# EAGLE design InstrumentationBoard (EAGLE 7.2.0)
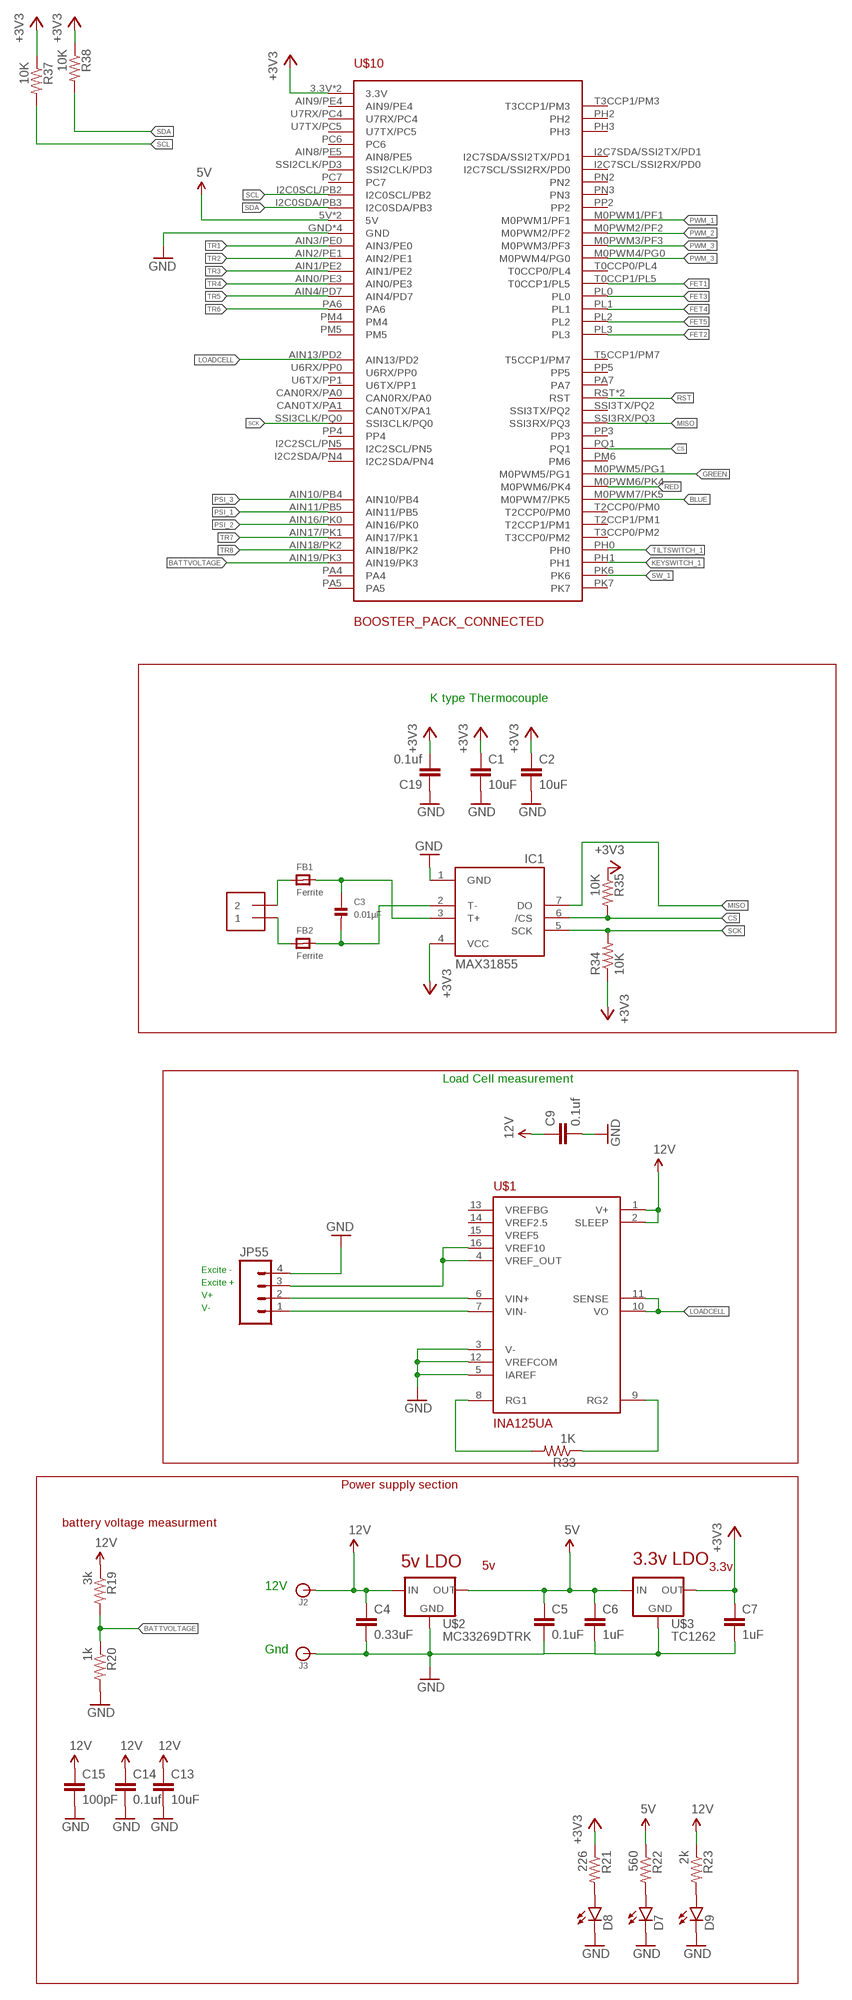
[diagram p0: schematic, sheet 1, part 1 of 2]
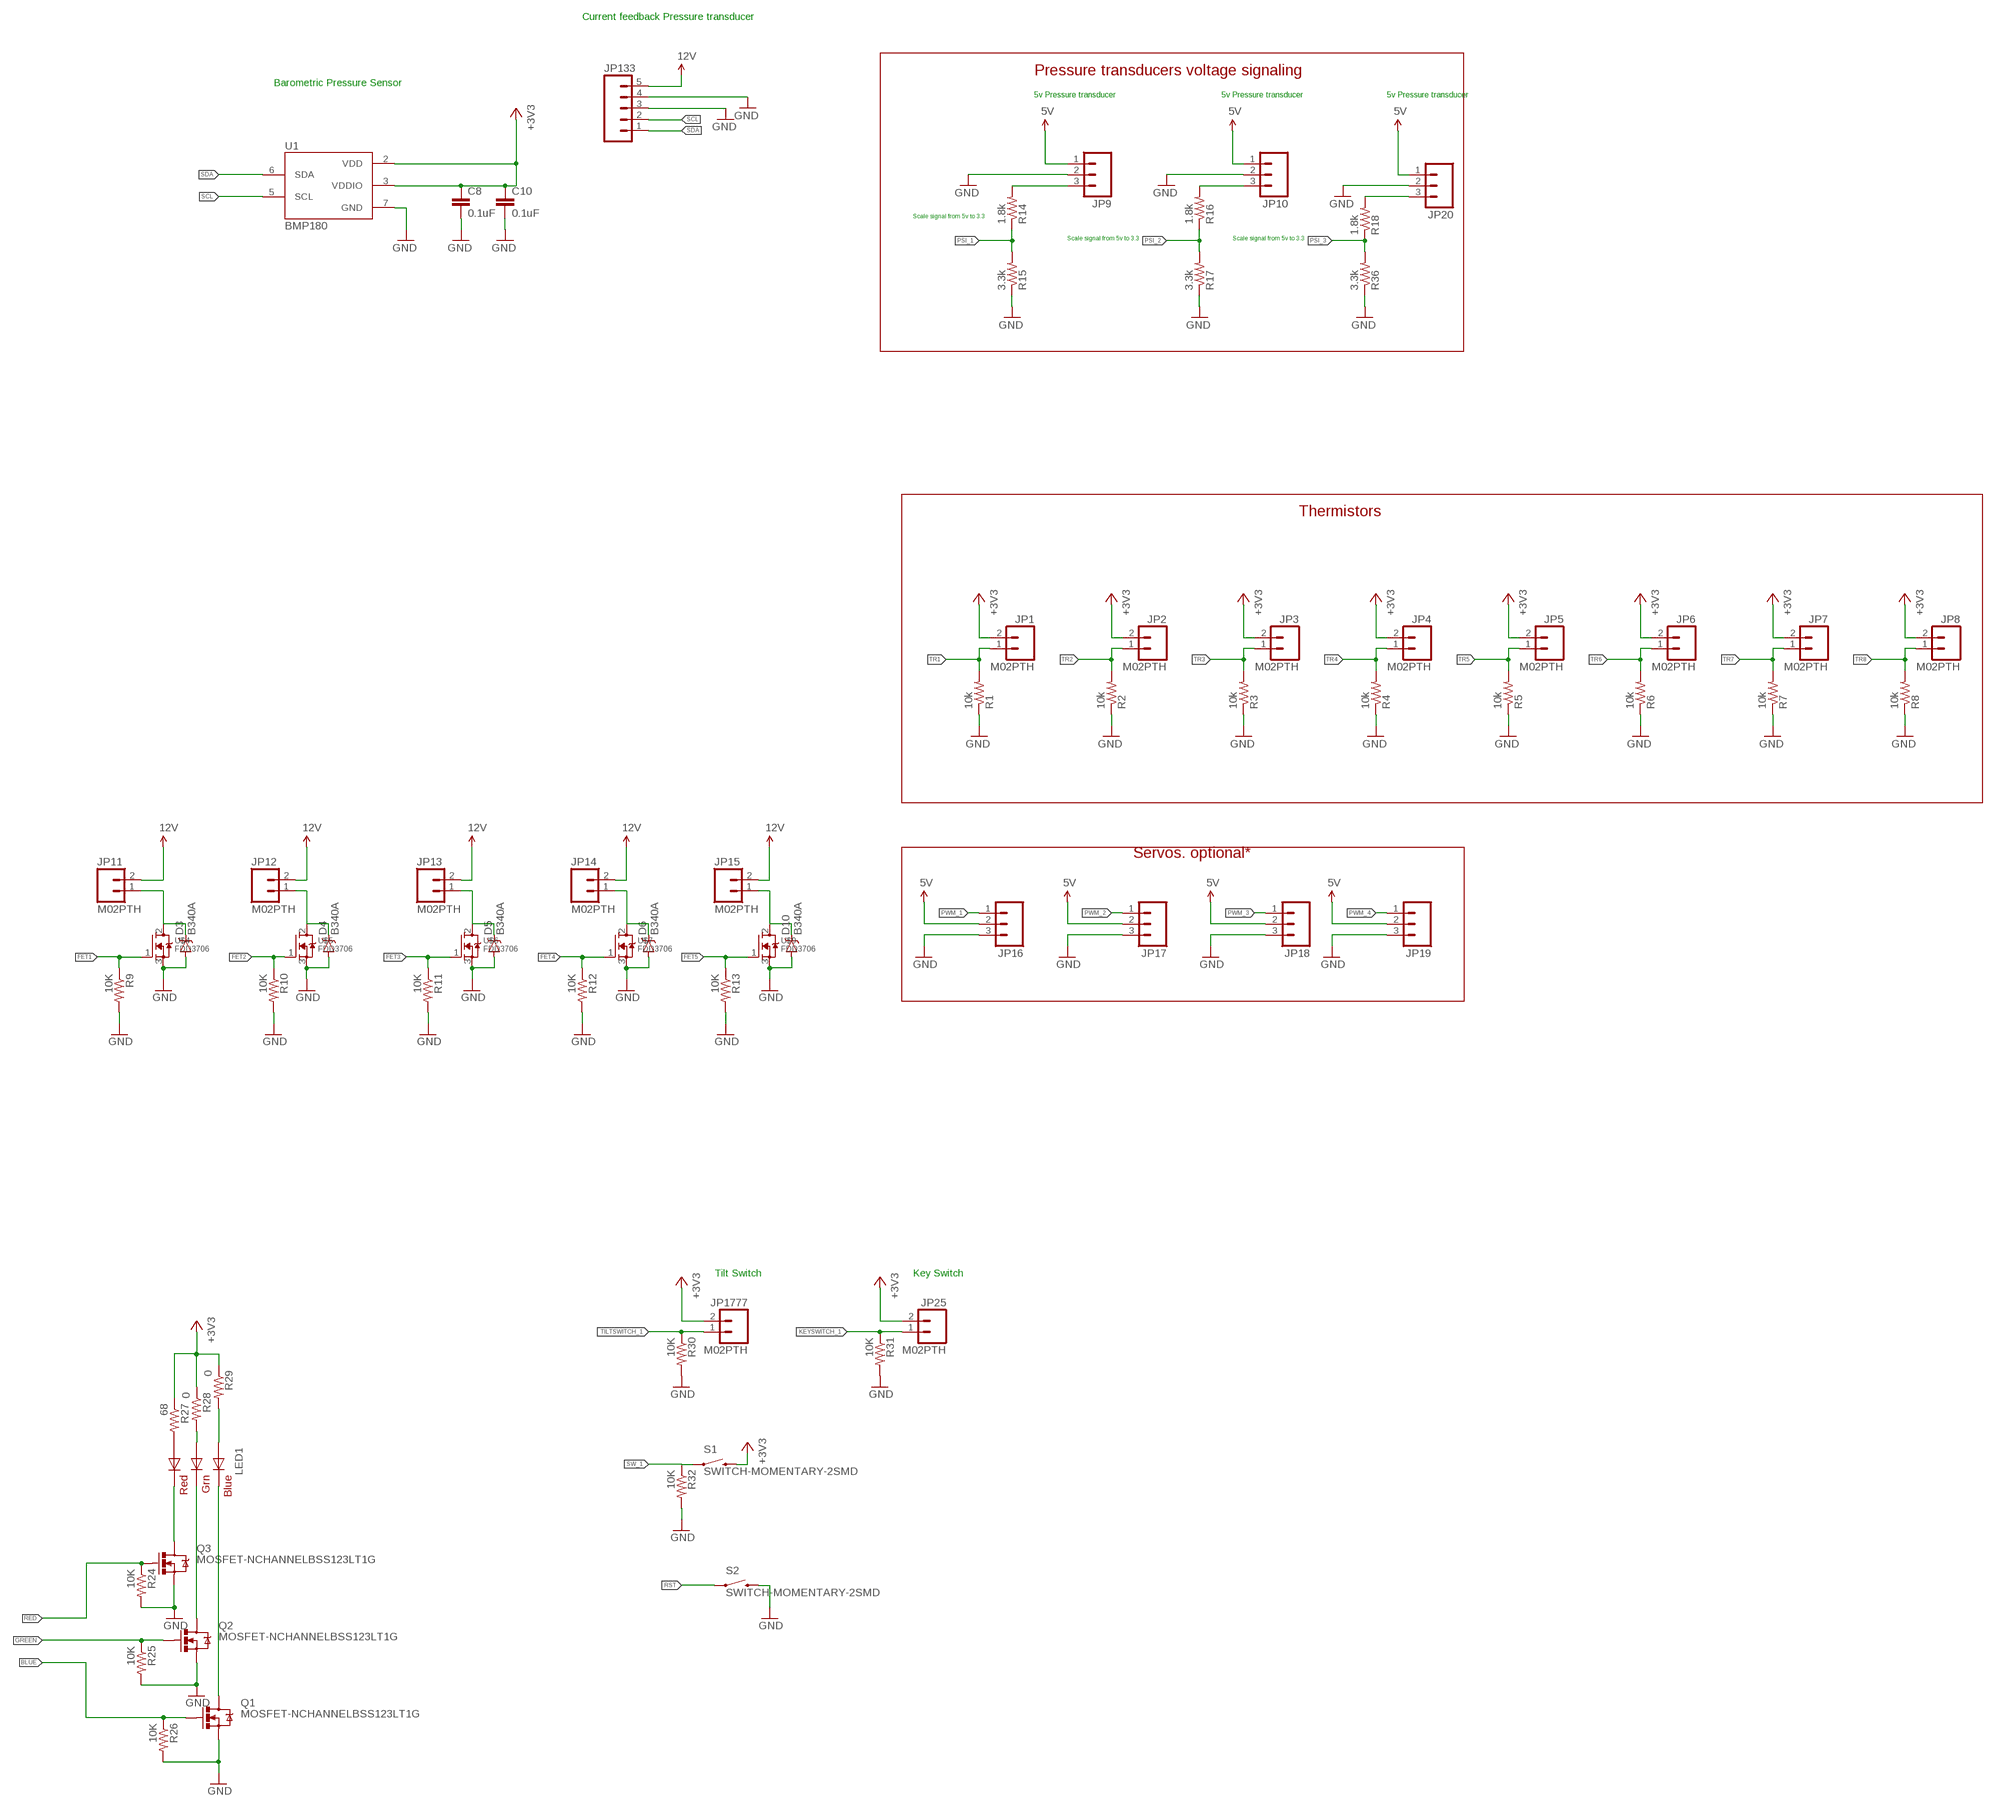
[diagram p1: schematic, sheet 1, part 2 of 2]

## Parts
C1  10uF  CAP0805  [0805]
C2  10uF  CAP0805  [0805]
C3  0.01µF  CAP_CERAMIC_0805  [_0805]
C4  0.33uF  CAP0805  [0805]
C5  0.1uF  CAP0805  [0805]
C6  1uF  CAP0805  [0805]
C7  1uF  CAP0805  [0805]
C8  0.1uF  CAP0805  [0805]
C9  0.1uf  CAP0805  [0805]
C10  0.1uF  CAP0805  [0805]
C13  10uF  CAP0805  [0805]
C14  0.1uf  CAP0805  [0805]
C15  100pF  CAP0805  [0805]
C19  0.1uf  CAP0805  [0805]
D3  B340A  DIODE-SCHOTTKY-B340A  [SMA-DIODE]
D4  B340A  DIODE-SCHOTTKY-B340A  [SMA-DIODE]
D5  B340A  DIODE-SCHOTTKY-B340A  [SMA-DIODE]
D6  B340A  DIODE-SCHOTTKY-B340A  [SMA-DIODE]
D7  LED1206  [LED-1206]
D8  LED1206  [LED-1206]
D9  LED1206  [LED-1206]
D10  B340A  DIODE-SCHOTTKY-B340A  [SMA-DIODE]
FB1  Ferrite  FERRITE_0805  [_0805]
FB2  Ferrite  FERRITE_0805  [_0805]
IC1  MAX31855  MAX6675  [SO08]
J1  1X2-3.5MM  [1X2-3.5MM]
J2  BANANA_CONN  [BANANA_CONN]
J3  BANANA_CONN  [BANANA_CONN]
JP1  M02PTH  [1X02]
JP2  M02PTH  [1X02]
JP3  M02PTH  [1X02]
JP4  M02PTH  [1X02]
JP5  M02PTH  [1X02]
JP6  M02PTH  [1X02]
JP7  M02PTH  [1X02]
JP8  M02PTH  [1X02]
JP9  M03PTH  [1X03]
JP10  M03PTH  [1X03]
JP11  M02PTH  [1X02]
JP12  M02PTH  [1X02]
JP13  M02PTH  [1X02]
JP14  M02PTH  [1X02]
JP15  M02PTH  [1X02]
JP16  M03PTH  [1X03]
JP17  M03PTH  [1X03]
JP18  M03PTH  [1X03]
JP19  M03PTH  [1X03]
JP20  M03PTH  [1X03]
JP25  M02PTH  [1X02]
JP55  M04PTH  [1X04]
JP133  M05PTH  [1X05]
JP1777  M02PTH  [1X02]
LED1  RGBLED5050  [RGBLED5050]
Q1  MOSFET-NCHANNELBSS123LT1G  [SOT23-3]
Q2  MOSFET-NCHANNELBSS123LT1G  [SOT23-3]
Q3  MOSFET-NCHANNELBSS123LT1G  [SOT23-3]
R1  10k  RESISTOR0805-RES  [0805]
R2  10k  RESISTOR0805-RES  [0805]
R3  10k  RESISTOR0805-RES  [0805]
R4  10k  RESISTOR0805-RES  [0805]
R5  10k  RESISTOR0805-RES  [0805]
R6  10k  RESISTOR0805-RES  [0805]
R7  10k  RESISTOR0805-RES  [0805]
R8  10k  RESISTOR0805-RES  [0805]
R9  10K  RESISTOR0805-RES  [0805]
R10  10K  RESISTOR0805-RES  [0805]
R11  10K  RESISTOR0805-RES  [0805]
R12  10K  RESISTOR0805-RES  [0805]
R13  10K  RESISTOR0805-RES  [0805]
R14  1.8k  RESISTOR0805-RES  [0805]
R15  3.3k  RESISTOR0805-RES  [0805]
R16  1.8k  RESISTOR0805-RES  [0805]
R17  3.3k  RESISTOR0805-RES  [0805]
R18  1.8k  RESISTOR0805-RES  [0805]
R19  3k  RESISTOR0805-RES  [0805]
R20  1k  RESISTOR0805-RES  [0805]
R21  226  RESISTOR0805-RES  [0805]
R22  560  RESISTOR0805-RES  [0805]
R23  2k  RESISTOR0805-RES  [0805]
R24  10K  RESISTOR0805-RES  [0805]
R25  10K  RESISTOR0805-RES  [0805]
R26  10K  RESISTOR0805-RES  [0805]
R27  68  RESISTOR0805-RES  [0805]
R28  0  RESISTOR0805-RES  [0805]
R29  0  RESISTOR0805-RES  [0805]
R30  10K  RESISTOR0805-RES  [0805]
R31  10K  RESISTOR0805-RES  [0805]
R32  10K  RESISTOR0805-RES  [0805]
R33  1K  RESISTOR0805-RES  [0805]
R34  10K  RESISTOR0805-RES  [0805]
R35  10K  RESISTOR0805-RES  [0805]
R36  3.3k  RESISTOR0805-RES  [0805]
R37  10K  RESISTOR0805-RES  [0805]
R38  10K  RESISTOR0805-RES  [0805]
S1  SWITCH-MOMENTARY-2SMD  [TACTILE-SWITCH-SMD]
S2  SWITCH-MOMENTARY-2SMD  [TACTILE-SWITCH-SMD]
U1  BMP180  [BMP180]
U$1  INA125UA  [SO16]
U$2  MC33269DTRK  [TO-252]
U$3  TC1262  [SOT223]
U$4  FDD3706  [TO-252]
U$5  FDD3706  [TO-252]
U$6  FDD3706  [TO-252]
U$7  FDD3706  [TO-252]
U$9  FDD3706  [TO-252]
U$10  BOOSTER_PACK_CONNECTED  [TI_CONNECTED_BOOSTER]

## Nets
5V: C5.1 C6.1 JP9.1 JP10.1 JP16.2 JP17.2 JP18.2 JP19.2 JP20.1 R22.1 U$2.2(OUT) U$3.1(IN) U$10.5V U$10.5V1(5V)
12V: C4.1 C9.1 C13.1 C14.1 C15.1 J2.P$1 JP11.2 JP12.2 JP13.2 JP14.2 JP15.2 JP133.5 R19.1 R23.1 U$1.1(V+) U$1.2(SLEEP) U$2.3(IN)
+3V3: C1.1 C2.1 C7.1 C8.1 C10.1 C19.2 IC1.4(VCC) JP1.2 JP2.2 JP3.2 JP4.2 JP5.2 JP6.2 JP7.2 JP8.2 JP25.2 JP1777.2 R21.1 R27.1 R28.1 R29.1 R34.1 R35.1 R37.1 R38.1 S1.3 U1.2(VDD) U1.3(VDDIO) U$3.3(OUT) U$10.3.3V U$10.3.3V1(3.3V)
BATTVOLTAGE: R19.2 R20.1 U$10.AIN19/PK3
BLUE: Q1.1(G) R26.1 U$10.M0PWM7/PK5
CS: IC1.6(/CS) R35.2 U$10.PQ1
EXCITE+: JP55.3 U$1.4(VREF_OUT) U$1.16(VREF10)
FET1: R9.1 U$4.1(G) U$10.T0CCP1/PL5
FET2: R10.1 U$5.1(G) U$10.PL3
FET3: R11.1 U$6.1(G) U$10.PL0
FET4: R12.1 U$7.1(G) U$10.PL1
FET5: R13.1 U$9.1(G) U$10.PL2
GND: C1.2 C2.2 C4.2 C5.2 C6.2 C7.2 C8.2 C9.2 C10.2 C13.2 C14.2 C15.2 C19.1 D3.A D4.A D5.A D6.A D7.C D8.C D9.C D10.A IC1.1(GND) J3.P$1 JP9.2 JP10.2 JP16.3 JP17.3 JP18.3 JP19.3 JP20.2 JP55.4 JP133.3 JP133.4 Q1.2(S) Q2.2(S) Q3.2(S) R1.1 R2.1 R3.1 R4.1 R5.1 R6.1 R7.1 R8.1 R9.2 R10.2 R11.2 R12.2 R13.2 R15.1 R17.1 R20.2 R24.2 R25.2 R26.2 R30.2 R31.2 R32.2 R36.1 S2.3 U1.7(GND) U$1.3(V-) U$1.5(IAREF) U$1.12(VREFCOM) U$2.1(GND) U$3.2(GND) U$4.3(S) U$5.3(S) U$6.3(S) U$7.3(S) U$9.3(S) U$10.GND U$10.GND1(GND) U$10.GND2(GND) U$10.GND3(GND)
GREEN: Q2.1(G) R25.1 U$10.M0PWM5/PG1
KEYSWITCH_1: JP25.1 R31.1 U$10.PH1
LOADCELL: U$1.10(VO) U$1.11(SENSE) U$10.AIN13/PD2
MISO: IC1.7(DO) U$10.SSI3RX/PQ3
N$2: JP9.3 R14.2
N$3: LED1.5(RED_C) Q3.3(D)
N$7: LED1.6(GREEN_C) Q2.3(D)
N$8: LED1.4(BLUE_C) Q1.3(D)
N$9: LED1.2(RED_A) R27.2
N$10: LED1.1(GREEN_A) R28.2
N$13: R33.2 U$1.8(RG1)
N$14: R33.1 U$1.9(RG2)
N$15: LED1.3(BLUE_A) R29.2
N$17: D6.C JP14.1 U$7.2(D)
N$18: D3.C JP11.1 U$4.2(D)
N$19: D4.C JP12.1 U$5.2(D)
N$21: JP10.3 R16.2
N$22: D5.C JP13.1 U$6.2(D)
N$23: D7.A R22.2
N$24: D8.A R21.2
N$25: D9.A R23.2
N$26: D10.C JP15.1 U$9.2(D)
N$27: JP20.3 R18.2
PSI_1: R14.1 R15.2 U$10.AIN11/PB5
PSI_2: R16.1 R17.2 U$10.AIN16/PK0
PSI_3: R18.1 R36.2 U$10.AIN10/PB4
PWM_1: JP16.1 U$10.M0PWM1/PF1
PWM_2: JP17.1 U$10.M0PWM2/PF2
PWM_3: JP18.1 U$10.M0PWM3/PF3
PWM_4: JP19.1 U$10.M0PWM4/PG0
RED: Q3.1(G) R24.1 U$10.M0PWM6/PK4
RST: S2.1 U$10.RST U$10.RST1(RST)
SCK: IC1.5(SCK) R34.2 U$10.SSI3CLK/PQ0
SCL: JP133.2 R37.2 U1.5(SCL) U$10.I2C0SCL/PB2
SDA: JP133.1 R38.2 U1.6(SDA) U$10.I2C0SDA/PB3
SW_1: R32.1 S1.1 U$10.PK6
T+: C3.1 FB1.2 IC1.3(T+)
T-: C3.2 FB2.2 IC1.2(T-)
TILTSWITCH_1: JP1777.1 R30.1 U$10.PH0
TR1: JP1.1 R1.2 U$10.AIN3/PE0
TR2: JP2.1 R2.2 U$10.AIN2/PE1
TR3: JP3.1 R3.2 U$10.AIN1/PE2
TR4: JP4.1 R4.2 U$10.AIN0/PE3
TR5: JP5.1 R5.2 U$10.AIN4/PD7
TR6: JP6.1 R6.2 U$10.PA6
TR7: JP7.1 R7.2 U$10.AIN17/PK1
TR8: JP8.1 R8.2 U$10.AIN18/PK2
TT+: FB1.1 J1.2
TT-: FB2.1 J1.1
VIN+: JP55.2 U$1.6(VIN+)
VIN-: JP55.1 U$1.7(VIN-)
Unconnected: U$1.13(VREFBG) U$1.14(VREF2.5) U$1.15(VREF5) U$10.AIN8/PE5 U$10.AIN9/PE4 U$10.CAN0RX/PA0 U$10.CAN0TX/PA1 U$10.I2C2SCL/PN5 U$10.I2C2SDA/PN4 U$10.I2C7SCL/SSI2RX/PD0 U$10.I2C7SDA/SSI2TX/PD1 U$10.PA4 U$10.PA5 U$10.PA7 U$10.PC6 U$10.PC7 U$10.PH2 U$10.PH3 U$10.PK7 U$10.PM4 U$10.PM5 U$10.PM6 U$10.PN2 U$10.PN3 U$10.PP2 U$10.PP3 U$10.PP4 U$10.PP5 U$10.SSI2CLK/PD3 U$10.SSI3TX/PQ2 U$10.T0CCP0/PL4 U$10.T2CCP0/PM0 U$10.T2CCP1/PM1 U$10.T3CCP0/PM2 U$10.T3CCP1/PM3 U$10.T5CCP1/PM7 U$10.U6RX/PP0 U$10.U6TX/PP1 U$10.U7RX/PC4 U$10.U7TX/PC5

## Notes on the sheet
- Current feedback Pressure transducer
- Pressure transducers voltage signaling
- Barometric Pressure Sensor
- 5v Pressure transducer | 5v Pressure transducer | 5v Pressure transducer
- Scale signal from 5v to 3.3
- Scale signal from 5v to 3.3 | Scale signal from 5v to 3.3
- Thermistors
- K type Thermocouple
- Servos. optional*
- Load Cell measurement
- Excite -
- Excite +
- V+
- V-
- Power supply section
- battery voltage measurment | Tilt Switch | Key Switch
- 5v LDO | 3.3v LDO
- 12V
- Gnd

## Library data of the parts
C1 C2 C4-C10 C14 C15 C19 = SparkFun-Capacitors:CAP: Capacitor Standard 0603 ceramic capacitor, and 0.1" leaded capacitor.
C3 = microbuilder:CAP_CERAMIC: Ceramic Capacitors 0402 - 0402 Surface Mount Capacitors 16pF 50V 5% [Digikey: 445-4899-2-ND] 18pF 50V 5% [Digikey: 490-1281-2-ND] 22pF 50V 5% [Digikey: 490-1283-2-ND] 68pF 50V 5% [Digikey: 490-1289-2-ND] 0.1uF 10V 10% [Digikey: 490-1318-2-ND] 1.0uF 6.3V 10% [Digikey: 490-1320-2-ND] 0603 - 0603 Surface Mount Capacitors 16 pF 50V 5% [Digikey: 445-5051-2-ND] 22 pF 50V [Digikey: PCC220ACVTR-ND] 33 pF 50V 5% [Digikey: 490-1415-1-ND] 56pF 50V 5% [Digikey: 490-1421-1-ND] 220pF 50V 5% [Digikey: 445-1285-1-ND] 680 pF 50V 2200 pF 50V 5% C0G [Digikey: 445-1297-1-ND] 5600 pF 100V 5% X7R [Digikey: 478-3711-1-ND] 0.1 µF 25V 10% [Digikey: PCC2277TR-ND] 0.22 µF 16V 10% X7R [Digikey: 445-1318-1-ND] 1.0 µF 25V 10% [Digikey: 445-5146-2-ND] 0603 - RF Specific 3pF 250V +/-0.1pF RF [Digikey: 712-1347-1-ND] 18 pF 250V 5% [Digikey: 478-3505-1-ND or 712-1322-1-ND] 56 pF 250V 5% C0G RF [Digikey: 490-4867-1-ND] 68 pF 250V RF [Digikey: 490-4868-1-ND] 0805 - 0805 Surface Mount Capacitors 220 pF 250V 2% RF Ceramic Capacitor [Digikey: 712-1398-1-ND] 1000 pF 50V 2% NP0 Ceramic Capacitor [Digikey: 478-3760-1-ND] 0.1 µF 25V 10% Ceramic Capacitor [Digikey: PCC1828TR-ND] 1.0 µF 16V 10% Ceramic Capacitor[Digikey: 490-1691-2-ND] 10.0 µF 10V 10% Ceramic Capacitor[Digikey: 709-1228-1-ND] 10.0 uF 16V 10% Ceramic Capacitor [Digikey: 478-5165-2-ND] 47 uF 6.3V 20% Ceramic Capacitor [Digikey: 587-1779-1-ND or 399-5506-1-ND] 1206 - 1206 Surface Mount Capacitors 47uF 10V 20% Ceramic Capacitor [Digikey: 490-5528-1-ND or 399-5508-1-ND or 445-6010-1-ND] 100uF 6.3V -20%, +80% Y5V Ceramic Capacitor (Digikey: 490-4512-1-ND, Mouser: 81-GRM31CF50J107ZE1L); DIGIKEY: 490-1664-1-ND
C13 = SparkFun-Capacitors:CAP: Capacitor Standard 0603 ceramic capacitor, and 0.1" leaded capacitor.; DIGIKEY: 490-3886-1-ND
D3-D6 D10 = SparkFun-DiscreteSemi:DIODE-SCHOTTKY: Schottky diodes in SFE's production catalog BAT20J 1A 23V 0.62Vf RB751 120mA 40V 0.37Vf PMEG4005EJ 0.5A 40V 0.42Vf MBRA140 1A 40V 0.5Vf B340A 3A 40V SMA; DIGIKEY: SS110-TPCT-ND; PROD_ID: DIO-09886
D7-D9 = SparkFun-LED:LED: LEDs Standard schematic elements and footprints for 5mm, 3mm, 1206, and 0603 sized LEDs. 5mm - Spark Fun Electronics SKU : COM-00529 (and others); DIGIKEY: 160-1405-1-ND
FB1 FB2 = microbuilder:FERRITE: Ferrite Bead 0603 MMZ1608B121C - 120 Ohm @ 100MHz, 600mA, 0.15 Ohm DC Resistance - Digikey: 445-2164-1-ND BK1608HW121-T - 120 Ohm, 600mA Ferrite Chip - Digikey: 587-1876-2-ND 0805 HZ0805B272R-10 - 2.7K Ohm @ 100MHz, 200mA, 0.8 Ohm DC Resistance - Digikey: 240-2504-1-ND (see also Murata BLM21BD272SN1L) MMZ2012Y152B - 1.5K Ohm @ 100MHz, 500mA, 0.4 Ohm DC Resistance - Digikey: 445-1560-1-ND - Mainly for high frequency (80-400MHz) MMZ2012R102A - 1K Ohm @ 100MHz, 500mA, 0.3 Ohm DC Resistance - Digikey: 445-1555-2-ND - More general purpose (10-200MHz); DIGIKEY: 732-1609-1-ND
IC1 = adafruit:MAX6675
J1 = adafruit:1X2: 3.5mm Terminal block http://www.ladyada.net/library/pcb/eaglelibrary.html
J2 J3 = SparkFun-Connectors:BANANA_CONN: Through-hole banana jack
JP1-JP8 JP11-JP15 JP25 JP1777 = SparkFun-Connectors:M02: Standard 2-pin 0.1" header. Use with - straight break away headers ( PRT-00116) - right angle break away headers (PRT-00553) - swiss pins (PRT-00743) - machine pins (PRT-00117) - female headers (PRT-00115) Molex polarized connector foot print use with: PRT-08233 with associated crimp pins and housings. 2.54_SCREWTERM for use with PRT-10571. 3.5mm Screw Terminal footprints for PRT-08084 5mm Screw Terminal footprints for use with PRT-08432
JP9 JP10 JP16-JP20 = SparkFun-Connectors:M03: Header 3 Standard 3-pin 0.1" header. Use with straight break away headers (SKU : PRT-00116), right angle break away headers (PRT-00553), swiss pins (PRT-00743), machine pins (PRT-00117), and female headers (PRT-00115). Molex polarized connector foot print use with SKU : PRT-08232 with associated crimp pins and housings.
JP55 = SparkFun-Connectors:M04: Header 4 Standard 4-pin 0.1" header. Use with straight break away headers (SKU : PRT-00116), right angle break away headers (PRT-00553), swiss pins (PRT-00743), machine pins (PRT-00117), and female headers (PRT-00115). Molex polarized connector foot print use with SKU : PRT-08231 with associated crimp pins and housings. 1MM SMD Version SKU: PRT-10208
JP133 = SparkFun-Connectors:M05: Header 5 Standard 5-pin 0.1" header. Use with straight break away headers (SKU : PRT-00116), right angle break away headers (PRT-00553), swiss pins (PRT-00743), machine pins (PRT-00117), and female headers (PRT-00115). Molex polarized connector foot print use with SKU : PRT-08230 with associated crimp pins and housings.
LED1 = adafruit:RGBLED: For 5050 RGB LEDs, the order of the LEDs may vary from one manufacturer to another!; DIGIKEY: 1516-1131-1-ND
Q1-Q3 = SparkFun-DiscreteSemi:MOSFET-NCHANNEL: Common NMOSFET Parts MFG P/N Store ID Prod ID FDD8780 TRANS-09984 SI7820DN TRANS-11055 FDS6630A IC-08089 2N7002PW TRANS-11151 FQP30N06L COM-10213 TRANS-10060 BSS123LT1G TRANS-08345 BSS138 TRANS-00830 BS170 2N7000; PROD_ID: TRANS-08345
R1-R13 R19 R20 R24-R35 R37 R38 = SparkFun-Resistors:RESISTOR: Resistor Basic schematic elements and footprints for 0603, 1206, and PTH resistors.
R14 R16 R18 = SparkFun-Resistors:RESISTOR: Resistor Basic schematic elements and footprints for 0603, 1206, and PTH resistors.; DIGIKEY: RMCF0805FT1K80CT-ND
R15 R17 R36 = SparkFun-Resistors:RESISTOR: Resistor Basic schematic elements and footprints for 0603, 1206, and PTH resistors.; DIGIKEY: RHM3.30KCHCT-ND
R21 = SparkFun-Resistors:RESISTOR: Resistor Basic schematic elements and footprints for 0603, 1206, and PTH resistors.; DIGIKEY: P226CCT-ND
R22 = SparkFun-Resistors:RESISTOR: Resistor Basic schematic elements and footprints for 0603, 1206, and PTH resistors.; DIGIKEY: P560CCT-ND
R23 = SparkFun-Resistors:RESISTOR: Resistor Basic schematic elements and footprints for 0603, 1206, and PTH resistors.; DIGIKEY: P2.00KCCT-ND
S1 S2 = SparkFun-Electromechanical:SWITCH-MOMENTARY-2: Various NO switches- pushbuttons, reed, etc; PROD_ID: SWCH-08247
U1 = SparkFun-Sensors:BMP180: BOSCH BMP180 DIGITAL BAROMETRIC PRESSURE SENSOR Web page: http://www.bosch-sensortec.com/en/homepage/products_3/environmental_sensors_1/bmp180_1/bmp180 Datasheet: http://ae-bst.resource.bosch.com/media/products/dokumente/bmp180/BST-BMP180-DS000-09.pdf The BMP180 is the function compatible successor of the BMP085, a new generation of high precision digital pressure sensors for consumer applications. The ultra-low power, low voltage electronics of the BMP180 is optimized for use in mobile phones, PDAs, GPS navigation devices and outdoor equipment. With a low altitude noise of merely 0.25m at fast conversion time, the BMP180 offers superior performance. The I2C interface allows for easy system integration with a microcontroller. The BMP180 is based on piezo-resistive technology for EMC robustness, high accuracy and linearity as well as long term stability. Key features: - Temperature measurement included - I2C interface - Fully calibrated - Pb-free, halogen-free and RoHS compliant, - MSL 1 Basic specs: Pressure range: 300 to 1100hPa (+9000m to -500m relating to sea level) Supply voltage: 1.8 to 3.6V (VDD), 1.62V to 3.6V (VDDIO) Package: LGA package with metal lid Small footprint: 3.6mm x 3.8mm Super-flat: 0.93mm height Low power: 5μA at 1 sample / sec. in standard mode Low noise: 0.06hPa (0.5m) in ultra low power mode, 0.02hPa (0.17m) advanced resolution mode Typical applications: - Enhancement of GPS navigation (dead-reckoning, slope detection, etc.) - In- and out-door navigation - Leisure and sports - Weather forecast - Vertical velocity indication (rise/sink speed)
U$1 = RitLaunchInitiative:INA125UA: The INA125 is a low power, high accuracy instrumentation amplifier with a precision voltage reference. It provides complete bridge excitation and precision differential-input amplification on a single integrated circuit. -------------------------------------------------------------------------------------------------------------------------------- A single external resistor sets any gain from 4 to 10,000. The INA125 is laser-trimmed for low offset voltage (250µV), low offset drift (2µV/°C), and high common-mode rejection (100dB at G = 100). It operates on single (+2.7V to +36V) or dual (±1.35V to ±18V) supplies. -------------------------------------------------------------------------------------------------------------------------------- The voltage reference is externally adjustable with pinselectable voltages of 2.5V, 5V, or 10V, allowing use with a variety of transducers. The reference voltage is accurate to ±0.5% (max) with ±35ppm/°C drift (max). Sleep mode allows shutdown and duty cycle operation to save power.; DATASHEET_LINK: http://www.ti.com/lit/ds/symlink/ina125.pdf; DIGIKEY_PART_NUMBER: INA125UA-ND
U$2 = RitLaunchInitiative:MC33269DTRK: 5v Reg; DIGIKEY: MC33269DTRK-5.0GOSCT-ND
U$3 = RitLaunchInitiative:TC1262: 3.3v Reg; DIGIKEY: TC1262-3.3VDBCT-ND
U$4-U$7 U$9 = RitLaunchInitiative:FDD3706; DATASHEET_LINK: https://www.fairchildsemi.com/datasheets/FD/FDD3706.pdf; DIGIKEY_PART_NUMBER: FDD3706FSCT-ND
U$10 = RitLaunchInitiative:BOOSTER_PACK_CONNECTED

## Board
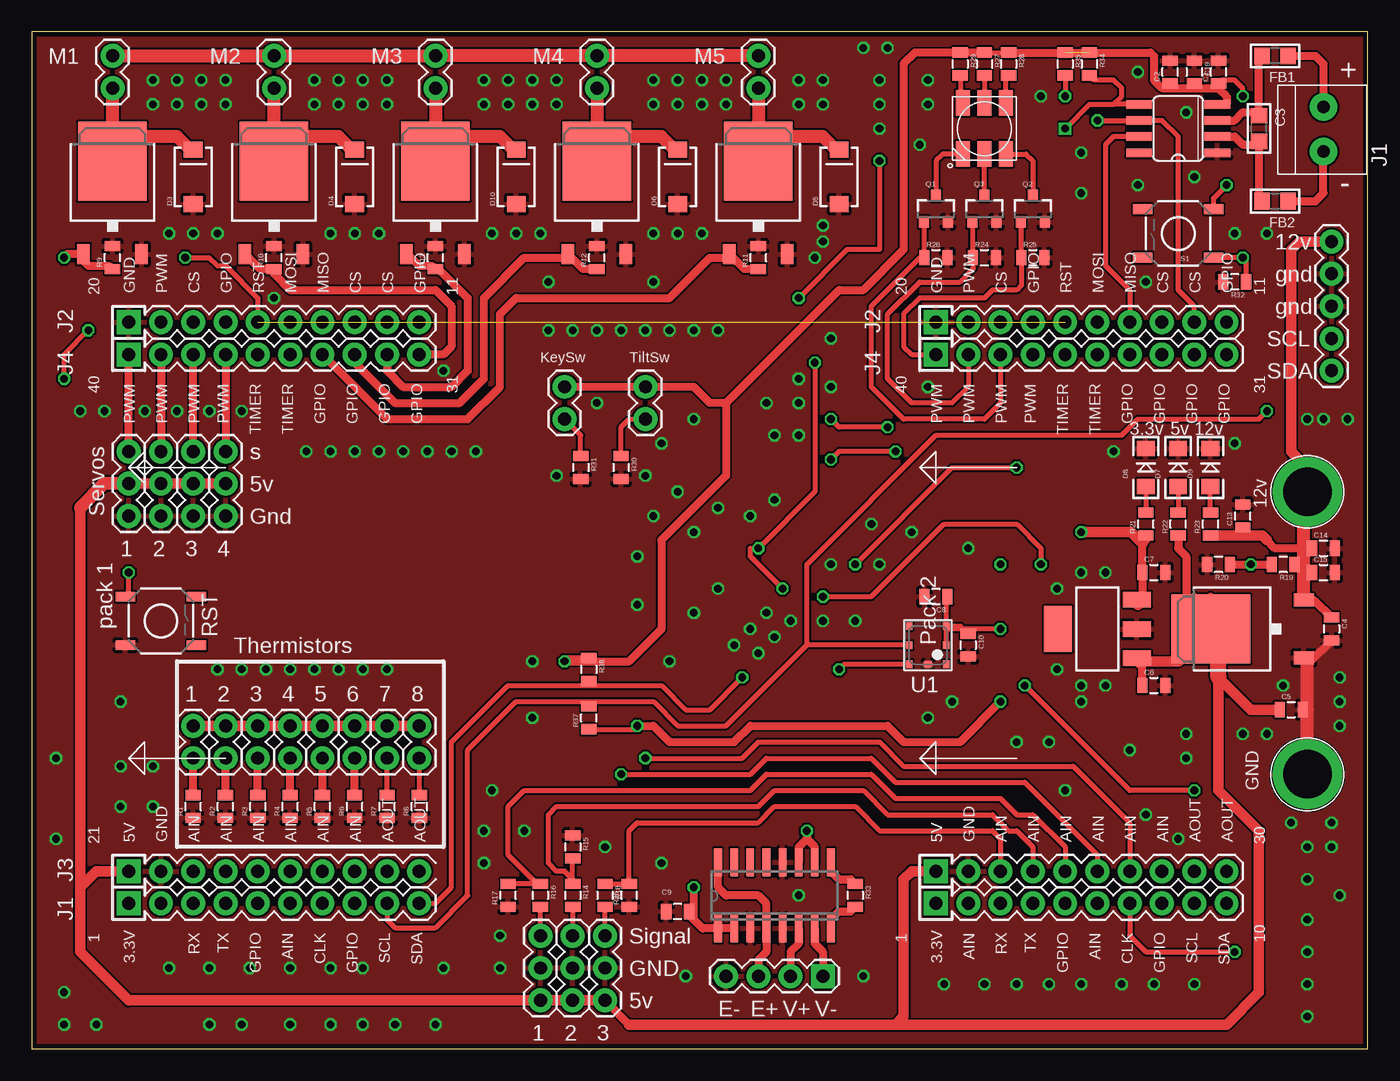
[diagram p2: board, top side]
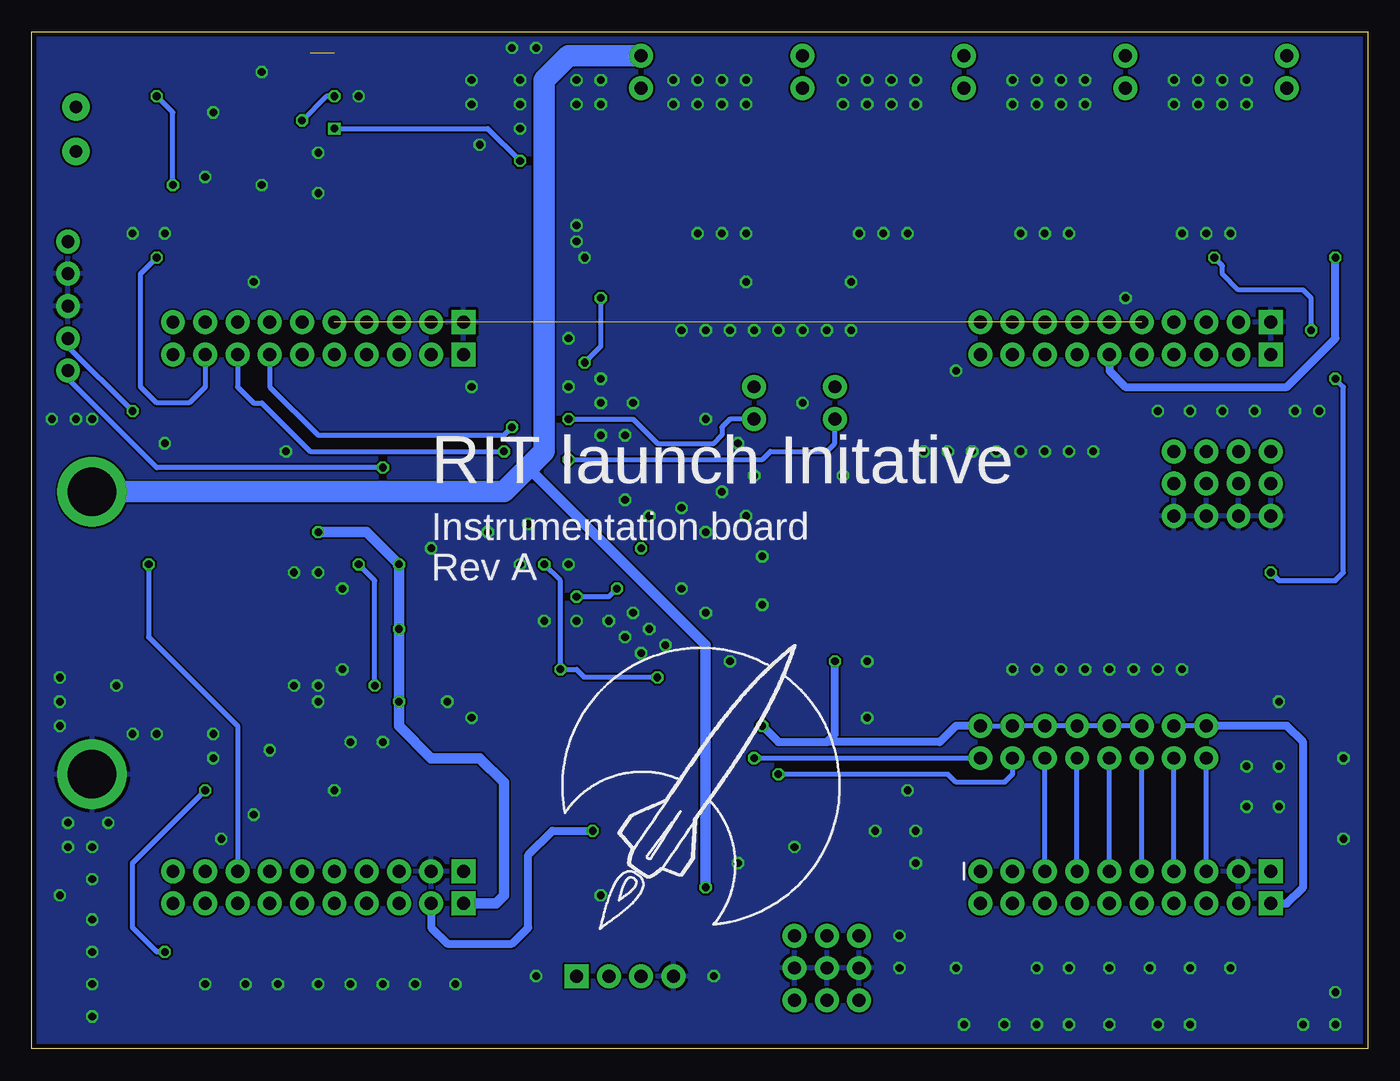
[diagram p3: board, bottom side, seen from below]

Size 105.08 x 80 mm. Coordinates in mm from the lower left corner, seen from the top.
Outline: 0,0 105.08,0 105.08,80 0,80 0,0
Copper layers (1*16): Top 0.0356mm / dielectric 1.5011mm / Bottom 0.0356mm
Design rules "LaenPCBOrder": minimum track width 6mil, minimum drill 13mil, track to track 6mil, track to pad 6mil, pad to pad 6mil, via to via 6mil, smd to smd 6mil, copper to edge 15mil, drill to drill 6mil, minimum pad ring 7mil, minimum via ring 7mil, stop-mask expansion 3mil, vias tented up to drill 0mil, thermal gap 10mil

### Footprints (pad centres in the part's own frame; a part is rotated, then mirrored left to right if it is on the bottom)
0805 = smd 0.8 x 1.2: 1 -0.9,0; 2 0.9,0
_0805 = smd 1.2 x 1.3: 1 -1.016,0; 2 1.016,0
SMA-DIODE = smd 1.27 x 1.47: A -2.15,0; C 2.15,0
LED-1206 = smd 1.2 x 1.4: A -1.5,0; C 1.5,0
SO08 = smd 0.66 x 2.032: 1 -1.905,-3.073; 2 -0.635,-3.073; 3 0.635,-3.073; 4 1.905,-3.073; 5 1.905,3.073; 6 0.635,3.073; 7 -0.635,3.073; 8 -1.905,3.073
1X2-3.5MM = drill 1 pad 2.184: 1 1.8,0; 2 -1.7,0
BANANA_CONN = drill 3.81 pad 5.461: P$1 0,0
1X02 = drill 1.016 pad 1.88: 1 0,0; 2 2.54,0
1X03 = drill 1.016 pad 1.88: 1 0,0; 2 2.54,0; 3 5.08,0
1X04 = drill 1.016 pad 1.88 square: 1 0,0 | drill 1.016 pad 1.88: 2 2.54,0; 3 5.08,0; 4 7.62,0
1X05 = drill 1.016 pad 1.88: 1 0,0; 2 2.54,0; 3 5.08,0; 4 7.62,0; 5 10.16,0
RGBLED5050 = smd 2 x 1.1: 1 -2,1.7; 2 -2,0; 3 -2,-1.7; 4 2,-1.7; 5 2,0; 6 2,1.7
SOT23-3 = smd 0.8 x 0.9: 1 -0.95,-1; 2 0.95,-1; 3 0,1.1
TACTILE-SWITCH-SMD = smd 1.524 x 0.762: 1 -2.794,1.905; 2 2.794,1.905; 3 -2.794,-1.905; 4 2.794,-1.905
BMP180 = smd 0.6 x 0.5: 1 1.5,1.45; 2 0,1.45; 3 -1.5,1.45; 4 -1.5,-1.45; 5 0,-1.45; 6 1.5,-1.45 | smd 0.5 x 0.6: 7 1.5,0
SO16 = smd 0.6 x 2.2: 1 -4.445,-2.6; 2 -3.175,-2.6; 3 -1.905,-2.6; 4 -0.635,-2.6; 5 0.635,-2.6; 6 1.905,-2.6; 7 3.175,-2.6; 8 4.445,-2.6; 9 4.445,2.6; 10 3.175,2.6; 11 1.905,2.6; 12 0.635,2.6; 13 -0.635,2.6; 14 -1.905,2.6; 15 -3.175,2.6; 16 -4.445,2.6
TO-252 = smd 1 x 1.6: 1 -2.28,-4.8; 3 2.28,-4.8 | smd 5.4 x 6.2: 2 0,2.5
SOT223 = smd 1.219 x 2.235: 1 -2.311,-3.099; 2 0,-3.099; 3 2.311,-3.099 | smd 3.6 x 2.2: 4 0,3.099
TI_CONNECTED_BOOSTER = drill 1.016 pad 1.88 square: 3.3V -22.86,25.4; 3.3V1 -22.86,-38.1; 5V -20.32,25.4; 5V1 -20.32,-38.1; GND1 22.86,25.4; GND3 22.86,-38.1; M0PWM1/PF1 20.32,25.4; M0PWM5/PG1 20.32,-38.1 | drill 1.016 pad 1.88: AIN0/PE3 -20.32,12.7; AIN1/PE2 -20.32,15.24; AIN2/PE1 -20.32,17.78; AIN3/PE0 -20.32,20.32; AIN4/PD7 -20.32,10.16; AIN8/PE5 -22.86,12.7; AIN9/PE4 -22.86,22.86; AIN10/PB4 -20.32,-43.18; AIN11/PB5 -20.32,-45.72; AIN13/PD2 -22.86,-40.64; AIN16/PK0 -20.32,-48.26; AIN17/PK1 -20.32,-50.8; AIN18/PK2 -20.32,-53.34; AIN19/PK3 -20.32,-55.88; CAN0RX/PA0 -22.86,-48.26; CAN0TX/PA1 -22.86,-50.8; GND -20.32,22.86; GND2 -20.32,-40.64; I2C0SCL/PB2 -22.86,5.08; I2C0SDA/PB3 -22.86,2.54; I2C2SCL/PN5 -22.86,-58.42; I2C2SDA/PN4 -22.86,-60.96; I2C7SCL/SSI2RX/PD0 22.86,10.16; I2C7SDA/SSI2TX/PD1 22.86,12.7; M0PWM2/PF2 20.32,22.86; M0PWM3/PF3 20.32,20.32; M0PWM4/PG0 20.32,17.78; M0PWM6/PK4 20.32,-40.64; M0PWM7/PK5 20.32,-43.18; PA4 -20.32,-58.42; PA5 -20.32,-60.96; PA6 -20.32,7.62; PA7 22.86,-45.72; PC6 -22.86,15.24; PC7 -22.86,7.62; PH0 20.32,-53.34; PH1 20.32,-55.88; PH2 22.86,20.32; PH3 22.86,17.78; PK6 20.32,-58.42; PK7 20.32,-60.96; PL0 20.32,10.16; PL1 20.32,7.62; PL2 20.32,5.08; PL3 20.32,2.54; PM4 -20.32,5.08; PM5 -20.32,2.54; PM6 22.86,-60.96; PN2 22.86,7.62; PN3 22.86,5.08; PP2 22.86,2.54; PP3 22.86,-55.88; PP4 -22.86,-55.88; PP5 22.86,-43.18; PQ1 22.86,-58.42; RST 22.86,15.24; RST1 22.86,-48.26; SSI2CLK/PD3 -22.86,10.16; SSI3CLK/PQ0 -22.86,-53.34; SSI3RX/PQ3 22.86,-53.34; SSI3TX/PQ2 22.86,-50.8; T0CCP0/PL4 20.32,15.24; T0CCP1/PL5 20.32,12.7; T2CCP0/PM0 20.32,-45.72; T2CCP1/PM1 20.32,-48.26; T3CCP0/PM2 20.32,-50.8; T3CCP1/PM3 22.86,22.86; T5CCP1/PM7 22.86,-40.64; U6RX/PP0 -22.86,-43.18; U6TX/PP1 -22.86,-45.72; U7RX/PC4 -22.86,20.32; U7TX/PC5 -22.86,17.78

### Placement (x,y rotation side)
C1  93.34,76.83 90 top
C2  89.53,76.83 90 top
C3  96.52,72.39 270 top
C4  102.23,33.02 270 top
C5  99.06,26.67 0 top
C6  88.27,28.57 0 top
C7  88.27,37.47 0 top
C8  71.12,35.56 180 top
C9  50.8,10.79 180 top
C10  73.66,31.75 270 top
C13  95.25,41.91 90 top
C14  101.6,39.37 0 top
C15  101.6,37.47 0 top
C19  91.44,76.83 270 top
D3  12.7,68.58 90 top
D4  25.4,68.58 90 top
D5  63.5,68.58 90 top
D6  50.8,68.58 90 top
D7  90.17,45.72 90 top
D8  87.63,45.72 90 top
D9  92.71,45.72 90 top
D10  38.1,68.58 90 top
FB1  97.79,78.11 180 top
FB2  97.79,66.67 180 top
IC1  90.17,72.39 90 top
J1  101.6,72.39 270 top
J2  100.33,43.81 0 top
J3  100.33,21.59 0 top
JP1  12.7,22.86 90 top
JP2  15.24,22.86 90 top
JP3  17.78,22.86 90 top
JP4  20.32,22.86 90 top
JP5  22.86,22.86 90 top
JP6  25.4,22.86 90 top
JP7  27.94,22.86 90 top
JP8  30.48,22.86 90 top
JP9  42.55,3.81 90 top
JP10  40.01,3.81 90 top
JP11  6.35,75.56 90 top
JP12  19.05,75.56 90 top
JP13  57.15,75.56 90 top
JP14  44.45,75.56 90 top
JP15  31.75,75.56 90 top
JP16  7.62,46.99 270 top
JP17  10.16,46.99 270 top
JP18  12.7,46.99 270 top
JP19  15.24,46.99 270 top
JP20  45.09,3.81 90 top
JP25  41.91,49.53 90 top
JP55  62.23,5.71 180 top
JP133  102.23,53.34 90 top
JP1777  48.26,49.53 90 top
LED1  74.93,72.39 270 top
Q1  71.12,66.04 0 top
Q2  78.74,66.04 0 top
Q3  74.93,66.04 0 top
R1  12.7,19.05 90 top
R2  15.24,19.05 90 top
R3  17.78,19.05 90 top
R4  20.32,19.05 90 top
R5  22.86,19.05 90 top
R6  25.4,19.05 90 top
R7  27.94,19.05 90 top
R8  30.48,19.05 90 top
R9  6.35,62.23 90 top
R10  19.05,62.23 90 top
R11  57.15,62.23 90 top
R12  44.45,62.23 90 top
R13  31.75,62.23 90 top
R14  42.55,12.06 270 top
R15  42.55,15.88 270 top
R16  40.01,12.06 270 top
R17  37.47,12.06 90 top
R18  45.09,12.06 270 top
R19  98.42,38.1 180 top
R20  93.34,38.1 180 top
R21  87.63,41.27 90 top
R22  90.17,41.27 90 top
R23  92.71,41.27 90 top
R24  74.93,62.23 0 top
R25  78.74,62.23 0 top
R26  71.12,62.23 0 top
R27  74.93,77.47 270 top
R28  76.83,77.47 270 top
R29  73.02,77.47 270 top
R30  46.36,45.72 270 top
R31  43.18,45.72 270 top
R32  94.61,60.33 180 top
R33  64.77,12.06 270 top
R34  83.19,77.47 270 top
R35  81.28,77.47 270 top
R36  46.99,12.06 90 top
R37  43.82,26.04 90 top
R38  43.82,29.84 270 top
S1  90.17,64.14 180 top
S2  10.16,33.66 0 top
U1  70.48,31.75 270 top
U$1  58.42,12.06 0 top
U$2  95.25,33.02 90 top
U$3  83.82,33.02 90 top
U$4  6.35,67.31 0 top
U$5  19.05,67.31 0 top
U$6  57.15,67.31 0 top
U$7  44.45,67.31 0 top
U$8  [RITLAUNCH_LOGO]  67.31,5.08 0 bottom
U$9  31.75,67.31 0 top
U$10  33.02,34.29 90 top

### Tracks (layer width: path | path; a pad name or v marks a point on that pad's centre or on a via)
5V
  Top 0.406: C6.1 87.36,30.21 87.63,30.48 | 90.17,30.48 92.71,33.02 92.71,31.11 93.34,30.48
  Top 0.61: 87.26,30.37 U$3.1 87.36,30.26 C6.1 | U$2.2 92.75,33.66 | 92.75,33.66 92.75,34.25 92.08,34.92 | 92.08,34.92 91.44,35.56 | 92.71,35.56 92.08,34.92 | JP20.1 46.99,1.91 | R22.1 90.17,39.37 90.8,38.73 90.8,35.6 92.75,33.66
  Top 0.813: 87.26,30.37 87.11,30.37 86.99,30.48 87.63,30.48 90.17,30.48 90.21,30.48 U$2.2 93.34,32.42 93.34,31.11 93.34,30.48 93.34,29.21 | C5.1 95.88,26.67 93.34,29.21 | 46.99,1.91 67.94,1.91 | 67.94,1.91 93.98,1.91 96.52,4.45 96.52,17.14 93.34,20.32 93.34,29.21 | U$10.5V1 69.21,13.97 68.58,13.34 68.58,2.54 67.94,1.91 | JP20.1 JP9.1 JP10.1 7.62,3.81 3.81,7.62 3.81,12.7 | 3.81,12.7 5.08,13.97 U$10.5V | JP16.2 JP17.2 JP18.2 JP19.2 | 3.81,42.55 3.81,12.7
  Top 1.016: JP16.2 5.71,44.45 3.81,42.55
  Top 1.27: 93.34,29.21 93.34,31.11
12V  (via drill 0.6)
  Top 0.61: U$2.3 100.85,35.3 C4.1 | 99.06,43.18 100.05,43.18 | 53.98,9.53 54.04,9.46 U$1.2 U$1.1 52.77,9.46 52.07,10.16 | 52.07,10.16 v52.07,12.7 | C9.1 51.7,10.53 52.07,10.16 | 97.16,40.01 97.79,39.37 99.69,39.37 100.05,39.02 100.05,38.83 R19.1 | C14.1 100.05,39.37 | C15.1 100.69,37.47 100.05,38.1 | C13.1 95.25,40.38
  Top 0.813: J2.P$1 100.33,45.72 99.06,46.99 99.06,62.87 99.69,63.5 JP133.5 | R23.1 95.25,40.38 96.78,40.38 97.16,40.01
  Top 1.016: U$2.3 100.05,38.1 100.05,39.02 100.05,39.37 100.05,43.18 100.05,43.53 J2.P$1 | JP13.2 JP14.2 JP15.2 JP12.2 JP11.2
  Bottom 0.813: v52.07,12.7 52.07,31.75 66.04,45.72
  Bottom 1.676: J2.P$1 67.94,43.81 66.04,45.72 64.77,46.99 64.77,76.2 62.87,78.11 JP13.2
+3V3  (via drill 0.6)  (1 unrouted)
  Top 0.406: 87.63,40.01 87.26,40.01 | 86.99,40.01 87.26,40.01 | 87.26,40.01 R21.1 | 75.97,33.25 v76.2,33.02 72.16,33.02 U1.3 | R29.1 R27.1 R28.1 | U1.2 U1.3 | U1.3 73.06,33.25 C10.1 | U1.3 71.94,35.48 C8.1 | R37.1 47.36,25.14 v47.62,25.4 | R38.1 42.18,30.75 v41.91,30.48 | S1.3 92.96,66.93 v93.98,67.94 | v95.25,74.93 95.25,75.56 94.61,76.2 93.61,76.2 C1.1
  Top 0.61: 87.26,35.67 U$3.3 87.36,35.78 C7.1 87.36,39.74 87.63,40.01 | v47.62,25.4 48.9,25.4 50.17,24.13 55.25,24.13 56.52,25.4 67.31,25.4 68.58,24.13 73.02,24.13 v76.2,27.3 | R27.1 69.48,78.37 68.58,77.47 68.58,62.87 65.41,59.69 63.5,59.69 54.61,50.8 | R28.1 R34.1 88,78.37 88.27,78.11 88.27,76.2 88.9,75.56 89.53,75.56 | 89.53,75.56 91.44,75.56 | 91.44,75.56 93.34,75.56 | 93.34,75.56 93.98,74.93 93.98,74.3 IC1.4 | 93.34,75.56 C1.1 | C19.2 91.44,75.56 | C2.1 89.53,75.56 | v41.91,30.48 46.99,30.48 49.53,33.02 49.53,40.01 54.61,45.09 54.61,50.8 | 54.61,50.8 53.34,50.8 52.07,52.07 JP1777.2 JP25.2
  Top 0.813: U$3.3 86.92,35 86.99,34.92 | v82.55,40.64 86.46,40.64 87.36,39.74 | JP8.2 JP1.2
  Bottom 0.406: JP1.2 JP2.2 | JP3.2 JP4.2 JP5.2 JP6.2 JP7.2 JP8.2 | v93.98,67.94 93.98,73.66 v95.25,74.93
  Bottom 0.61: JP8.2 32.38,25.4 33.66,24.13 42.55,24.13 | v47.62,25.4 46.36,24.13 42.55,24.13 | U$10.3.3V 6.35,11.43 5.08,12.7 5.08,24.13 6.35,25.4 JP1.2 | 42.55,24.13 41.91,24.77 v41.91,30.48
  Bottom 0.813: U$10.3.3V1 68.58,11.43 67.94,12.06 67.94,20.95 69.85,22.86 73.66,22.86 76.2,25.4 v76.2,27.3 v76.2,33.02 v76.2,38.1 78.74,40.64 v82.55,40.64
BATTVOLTAGE  (via drill 0.6)
  Top 0.61: R20.1 v95.88,38.1 R19.2
  Bottom 0.406: v95.88,38.1 95.88,32.38 88.9,25.4 U$10.AIN19/PK3
BLUE
  Top 0.406: Q1.1 70.17,62.28 R26.1 69.85,62.23 66.04,58.42 66.04,52.07 68.58,49.53 74.93,49.53 76.2,50.8 U$10.M0PWM7/PK5
CS  (via drill 0.6)
  Top 0.406: U$10.PQ1 91.44,58.42 90.17,59.69 90.17,71.75 88.9,73.03 IC1.6 v83.82,73.03 | R35.2 v81.28,74.93
  Bottom 0.406: v81.28,74.93 81.91,74.93 v83.82,73.03
EXCITE+
  Top 0.61: JP55.3 57.15,6.99 57.79,7.62 U$1.4 57.79,11.43 57.15,12.06 54.61,12.06 53.98,12.7 U$1.16
FET1  (via drill 0.6)
  Top 0.61: R9.1 6.09,61.59 4.45,61.59 4.07,61.97 U$4.1 2.82,62.51 v2.54,62.23
  Bottom 0.61: U$10.T0CCP1/PL5 20.32,53.34 19.05,52.07 6.35,52.07 2.54,55.88 v2.54,62.23
FET2
  Top 0.61: U$5.1 17.95,61.33 R10.1 19.05,60.96 20.32,59.69 31.75,59.69 33.02,58.42 33.02,55.24 32.38,54.61 U$10.PL3
FET3
  Top 0.61: R11.1 56.05,61.33 U$6.1 54.59,62.23 53.34,62.23 50.17,59.05 38.1,59.05 36.83,57.78 36.83,52.07 34.29,49.53 27.94,49.53 U$10.PL0
FET4
  Top 0.61: U$10.PL1 25.4,53.98 28.57,50.8 33.66,50.8 35.56,52.7 35.56,59.05 38.74,62.23 41.89,62.23 U$7.1 43.35,61.33 R12.1
FET5
  Top 0.61: U$9.1 29.57,62.51 30.48,61.59 31.48,61.59 R13.1 32.02,61.33 34.29,59.05 34.29,53.34 33.02,52.07 29.21,52.07 27.94,53.34 U$10.PL2
GND  (via drill 0.6)
  Top 0.61: 100.33,30.46 100.58,30.46 C4.2 | C5.2 100.33,26.67
  Top 1.016: J3.P$1 100.33,26.67 100.33,30.46 U$2.1
  other vias: 80.01,24.13 81.28,20.32 38.74,17.14 49.53,14.61 45.09,15.88 36.83,8.89 3.81,50.16 6.98,27.3 1.91,22.86 70.48,52.07 70.48,26.04 72.39,27.3 82.55,27.3 86.36,23.5 77.47,24.13 90.8,24.77 90.8,22.86 100.33,15.88 100.33,13.34 100.33,10.16 100.33,7.62 100.33,5.08 100.33,2.54 91.44,5.08 88.27,5.08 85.72,5.08 82.55,5.08 80.01,5.08 77.47,5.08 74.93,5.08 71.75,5.08 65.41,5.71 51.44,5.71 60.33,12.06 32.38,6.35 10.79,6.35 13.97,6.35 17.14,6.35 20.32,6.35 23.5,6.35 26.04,6.35 13.97,1.91 16.51,1.91 20.32,1.91 23.5,1.91 26.04,1.91 28.57,1.91 31.75,1.91 2.54,1.91 2.54,4.45 5.08,1.91 6.98,22.23 9.53,22.23 9.53,19.05 6.98,19.05 1.91,16.51 86.99,67.94 90.8,73.66 91.44,68.58 86.99,76.83 82.55,70.48 82.55,67.31 79.38,74.93 70.48,76.2 70.48,74.3 69.85,71.12 66.67,72.39 66.67,74.3 66.67,76.2 65.41,78.74 67.31,78.74 60.33,76.2 62.23,76.2 62.23,74.3 60.33,74.3 54.61,74.3 54.61,76.2 52.71,76.2 52.71,74.3 50.8,74.3 50.8,76.2 48.9,76.2 48.9,74.3 41.28,74.3 41.28,76.2 39.37,76.2 39.37,74.3 37.47,74.3 37.47,76.2 35.56,76.2 35.56,74.3 27.94,74.3 27.94,76.2 26.04,76.2 26.04,74.3 24.13,74.3 24.13,76.2 22.22,76.2 22.22,74.3 15.24,74.3 15.24,76.2 13.33,76.2 13.33,74.3 11.43,74.3 11.43,76.2 9.53,76.2 9.53,74.3 33.02,46.99 25.4,46.99 23.5,46.99 31.11,46.99 29.21,46.99 21.59,46.99 34.93,46.99 27.3,46.99 40.64,56.52 48.26,56.52 50.17,56.52 42.55,56.52 44.45,56.52 52.07,56.52 53.98,56.52 46.36,56.52 27.94,29.84 20.32,29.84 18.41,29.84 26.04,29.84 24.13,29.84 16.51,29.84 14.61,29.84 22.22,29.84 8.89,50.16 11.43,50.16 13.97,50.16 16.51,50.16 5.71,50.16 19.05,59.05 32.38,53.34 40.64,60.33 48.9,60.33 40.01,64.14 36.2,64.14 27.3,64.14 23.5,64.14 14.61,64.14 10.79,64.14 25.4,64.14 12.7,64.14 38.1,64.14 48.9,64.14 50.8,64.14 52.71,64.14 62.23,64.77 62.23,63.5 61.6,62.23 62.87,55.88 62.87,52.07 60.33,50.8 57.79,50.8 60.33,52.7 60.33,48.26 58.42,48.26 44.45,50.8 52.07,49.53 49.53,47.62 41.28,45.09 48.26,45.09 62.23,33.66 64.77,33.66 66.67,38.1 69.21,40.64 66.04,41.27 62.87,38.1 59.69,33.66 58.42,32.38 57.15,31.11 55.25,31.75 56.52,33.02 57.79,34.29 50.17,30.48 52.07,34.29 53.98,36.2 56.52,41.91 58.42,43.18 52.07,40.64 53.98,42.55 50.8,43.81 48.9,41.91 47.62,38.73 47.62,34.92 39.37,30.48 39.37,26.04 36.2,20.32 35.56,17.14 35.56,14.61 36.83,6.35 84.45,28.57 84.45,37.47 82.55,37.47 82.55,28.57 80.64,36.2 80.64,29.84 95.25,24.77 97.16,24.77 102.87,12.06 102.87,25.4 102.87,27.3 102.87,29.21 98.42,28.57 102.23,15.88 102.23,17.78 99.06,17.78 90.17,16.51 87.63,18.41 73.66,39.37 85.09,46.99 94.61,47.62 100.33,49.53 101.6,49.53 103.5,49.53 97.16,64.14 94.61,64.14 87.63,60.33
  pour Top: -5.08,80.01 113.03,80.01 113.03,0 -5.08,0
  pour Bottom: 0,80.01 109.22,80.01 109.22,0 0,0
GREEN
  Top 0.406: Q2.1 77.84,64.99 R25.1 77.84,60.06 77.47,59.69 75.56,59.69 74.93,59.05 69.85,59.05 68.58,57.78 68.58,55.24 69.21,54.61 U$10.M0PWM5/PG1
KEYSWITCH_1  (via drill 0.6)
  Top 0.406: v67.94,46.99 63.5,46.99 v62.87,46.35 | R31.1 43.18,48.26 JP25.1
  Bottom 0.406: U$10.PH1 88.9,52.07 87.63,50.8 86.99,50.8 83.19,46.99 v67.94,46.99 | v62.87,46.35 47.62,46.35 46.99,46.99 42.55,46.99 41.91,47.62 JP25.1
LOADCELL  (via drill 0.6)
  Top 0.61: v60.96,17.14 60.96,16.51 | U$1.10 61.6,15.88 60.96,16.51 | 60.96,16.51 60.33,15.88 U$1.11
  Bottom 0.61: U$10.AIN13/PD2 73.66,9.53 72.39,8.26 67.31,8.26 66.04,9.53 66.04,15.24 64.14,17.14 v60.96,17.14
MISO
  Top 0.406: IC1.7 85.09,71.75 84.45,71.12 84.45,61.59 86.36,59.69 U$10.SSI3RX/PQ3
N$2
  Top 0.406: R14.2 JP9.3
N$3
  Top 0.406: Q3.3 LED1.5
N$7
  Top 0.406: LED1.6 78.2,70.39 78.74,69.85 Q2.3
N$8
  Top 0.406: LED1.4 71.66,70.39 71.12,69.85 Q1.3
N$9
  Top 0.406: R27.2 LED1.2
N$10
  Top 0.406: LED1.1 76.63,76.36 R28.2
N$13
  Top 0.61: U$1.8 62.87,10.16 63.5,10.79 64.4,10.79 R33.2
N$14
  Top 0.61: U$1.9 62.87,13.97 63.5,13.34 64.4,13.34 R33.1
N$15
  Top 0.406: R29.2 73.02,74.59 LED1.3
N$17
  Top 1.016: D6.C 50.55,70.73 49.53,71.75 46.4,71.75 45.11,70.47 | 45.11,70.47 U$7.2 | JP14.1 44.45,71.12 45.11,70.47
N$18
  Top 1.016: 6.35,70.73 U$4.2 6.35,71.12 | 6.35,71.12 JP11.1 | D3.C 12.46,70.73 11.43,71.75 6.98,71.75 6.35,71.12
N$19
  Top 1.016: U$5.2 19.05,71.12 | 19.05,71.12 JP12.1 | D4.C 25.16,70.73 24.13,71.75 19.68,71.75 19.05,71.12
N$21
  Top 0.406: JP10.3 R16.2
N$22
  Top 1.016: D5.C 63.26,70.73 62.23,71.75 59.1,71.75 57.8,70.47 | 57.8,70.47 U$6.2 | JP13.1 57.15,71.12 57.8,70.47
N$23
  Top 0.406: D7.A R22.2
N$24
  Top 0.406: D8.A R21.2
N$25
  Top 0.406: R23.2 D9.A
N$26
  Top 1.016: D10.C 37.86,70.73 36.83,71.75 33.7,71.75 32.41,70.47 | 32.41,70.47 U$9.2 | JP15.1 31.75,71.12 32.41,70.47
N$27
  Top 0.406: JP20.3 R18.2
PSI_1
  Top 0.406: R15.2 R14.1 42.55,13.34 41.91,13.97 41.28,13.97 40.64,14.61 40.64,18.41 41.28,19.05 57.15,19.05 58.42,20.32 65.41,20.32 67.31,18.41 75.56,18.41 76.83,17.14 77.47,17.14 78.74,15.88 U$10.AIN11/PB5
PSI_2
  Top 0.406: R17.2 R16.1 39.74,12.96 37.47,15.24 37.47,19.05 38.74,20.32 56.52,20.32 57.79,21.59 66.04,21.59 67.94,19.68 76.2,19.68 77.47,18.41 78.74,18.41 81.28,15.88 U$10.AIN16/PK0
PSI_3
  Top 0.406: R18.1 R36.2 46.99,17.14 47.62,17.78 57.15,17.78 58.42,19.05 64.77,19.05 66.67,17.14 75.56,17.14 76.2,16.51 U$10.AIN10/PB4
PWM_1
  Top 0.61: JP16.1 U$10.M0PWM1/PF1
PWM_2
  Top 0.61: U$10.M0PWM2/PF2 JP17.1
PWM_3
  Top 0.61: JP18.1 U$10.M0PWM3/PF3
PWM_4
  Top 0.61: U$10.M0PWM4/PG0 JP19.1
RED
  Top 0.406: Q3.1 74.03,64.99 R24.1 74.03,61.33 73.02,60.33 69.85,60.33 67.31,57.78 67.31,52.7 69.21,50.8 72.39,50.8 73.66,52.07 U$10.M0PWM6/PK4
RST  (via drill 0.6)  (1 unrouted)
  Top 0.406: S2.1 7.62,35.56 v7.62,37.47 | v2.54,52.7 2.54,54.61 v4.45,56.52 | v12.06,62.23 13.97,62.23 14.61,61.59 15.24,61.59 17.78,59.05 U$10.RST
  Bottom 0.406: v7.62,37.47 6.98,36.83 2.54,36.83 1.91,37.47 1.91,52.07 v2.54,52.7 | v4.45,56.52 4.45,59.05 5.08,59.69 10.16,59.69 11.43,60.96 11.43,61.59 v12.06,62.23
SCK  (via drill 0.6)
  Top 0.406: IC1.5 85.09,74.3 | v81.28,72.39 83.19,74.3 85.09,74.3 | v66.67,69.85 66.67,62.87 64.14,62.87 v60.33,59.05 | U$10.SSI3CLK/PQ0 86.36,8.89 87.63,7.62 v94.61,7.62 | v91.44,20.32 86.36,20.32 v78.1,28.57 | v61.6,53.98 61.6,43.81 v57.15,39.37 56.52,39.37 56.52,38.73 v59.05,36.2 | v62.23,35.56 66.04,35.56 71.75,41.27 77.47,41.27 79.38,39.37 v79.38,38.1 | 85.09,74.3 85.72,74.93 85.72,75.56 85.09,76.2 83.55,76.2 R34.2
  Bottom 0.406: v81.28,72.39 69.21,72.39 v66.67,69.85 | v94.61,7.62 95.25,7.62 97.16,9.53 97.16,14.61 v91.44,20.32 | v78.1,28.57 78.1,36.83 v79.38,38.1 | v60.33,59.05 60.33,55.24 v61.6,53.98 | v62.23,35.56 59.69,35.56 v59.05,36.2
SCL  (via drill 0.6)
  Top 0.406: U$10.I2C0SCL/PB2 27.94,10.16 28.57,9.53 31.75,9.53 34.29,12.06 34.29,23.5 38.1,27.3 43.82,27.3 | 43.82,27.3 48.9,27.3 50.8,25.4 54.61,25.4 60.96,31.75 | U1.5 60.96,31.75 | 60.96,31.75 60.96,38.1 71.12,48.26 85.72,48.26 86.99,49.53 96.52,49.53 v97.16,50.16 | R37.2 43.82,27.3
  Bottom 0.406: JP133.2 102.23,55.24 v97.16,50.16
SDA  (via drill 0.6)
  Top 0.406: U$10.I2C0SDA/PB3 31.75,11.43 33.02,12.7 33.02,24.13 37.47,28.57 43.82,28.57 | 43.82,28.57 49.53,28.57 51.44,26.67 53.34,26.67 v55.88,29.21 | U1.6 63.91,30.25 v63.5,29.84 | R38.2 43.82,28.57 | v64.77,38.1 72.39,45.72 v77.47,45.72
  Bottom 0.406: JP133.1 102.23,52.7 95.25,45.72 v77.47,45.72 | v55.88,29.21 61.6,29.21 62.23,29.84 v63.5,29.84 63.5,36.83 v64.77,38.1
SW_1  (via drill 0.6)
  Top 0.406: S1.1 v95.25,62.23 95.52,61.97 R32.1
  Bottom 0.406: U$10.PK6 91.44,52.07 92.71,50.8 95.25,50.8 96.52,52.07 96.52,60.96 v95.25,62.23
T+
  Top 0.61: FB1.2 96.52,77.85 C3.1 96.27,73.66 95.25,73.66 94.61,73.03 IC1.3
T-
  Top 0.61: FB2.2 96.52,66.93 C3.2 96.27,71.12 95.25,71.12 94.61,71.75 IC1.2
TILTSWITCH_1  (via drill 0.6)
  Top 0.406: v67.31,48.9 63.5,48.9 v62.87,49.53 | R30.1 46.36,48.9 46.99,49.53 JP1777.1
  Bottom 0.406: U$10.PH0 86.36,52.07 82.55,48.26 67.94,48.26 v67.31,48.9 | v62.87,49.53 57.79,49.53 55.88,47.62 51.44,47.62 50.8,48.26 50.8,48.9 50.17,49.53 JP1777.1
TR1
  Top 0.61: R1.2 JP1.1
  Bottom 0.406: U$10.AIN3/PE0 JP1.1
TR2
  Top 0.61: R2.2 JP2.1
  Bottom 0.406: U$10.AIN2/PE1 JP2.1
TR3
  Top 0.61: R3.2 JP3.1
  Bottom 0.406: U$10.AIN1/PE2 JP3.1
TR4
  Top 0.61: R4.2 JP4.1
  Bottom 0.406: U$10.AIN0/PE3 JP4.1
TR5
  Top 0.61: R5.2 JP5.1
  Bottom 0.406: U$10.AIN4/PD7 JP5.1
TR6
  Top 0.61: R6.2 JP6.1
  Bottom 0.406: U$10.PA6 JP6.1
TR7  (via drill 0.6)
  Top 0.406: v46.36,21.59 56.52,21.59 57.79,22.86 66.04,22.86 67.94,20.95 78.1,20.95 83.82,15.24 U$10.AIN17/PK1 | R7.2 JP7.1
  Bottom 0.406: JP7.1 27.94,21.59 28.57,20.95 32.38,20.95 33.02,21.59 v46.36,21.59
TR8  (via drill 0.6)
  Top 0.406: v48.26,22.86 55.88,22.86 57.15,24.13 66.67,24.13 68.58,22.23 81.91,22.23 86.36,17.78 U$10.AIN18/PK2 | JP8.1 R8.2
  Bottom 0.406: JP8.1 v48.26,22.86
TT+
  Top 0.61: FB1.1 100.96,78.11 101.6,77.47 J1.2
TT-
  Top 0.61: FB2.1 100.96,66.67 101.6,67.31 J1.1
VIN+
  Top 0.61: U$1.6 60.33,8.26 59.69,7.62 JP55.2
VIN-
  Top 0.61: U$1.7 61.6,8.26 62.23,7.62 JP55.1

### Text on the board
tPlace: M1 | M2 | M3 | M4 | M5 | + | - | 12v | gnd | gnd | SCL | KeySw | TiltSw | SDA | 3.3v | 5v | 12v | s | 5v | 12v | Servos | Gnd | 1 | 2 | 3 | 4 | RST | Thermistors | 1 | 2 | 3 | 4 | 5 | 6 | 7 | 8 | GND | Signal | GND | 5v | E- | E+ | V+ | V- | 1 | 2 | 3
bPlace: RIT launch Initative | Instrumentation board | Rev A